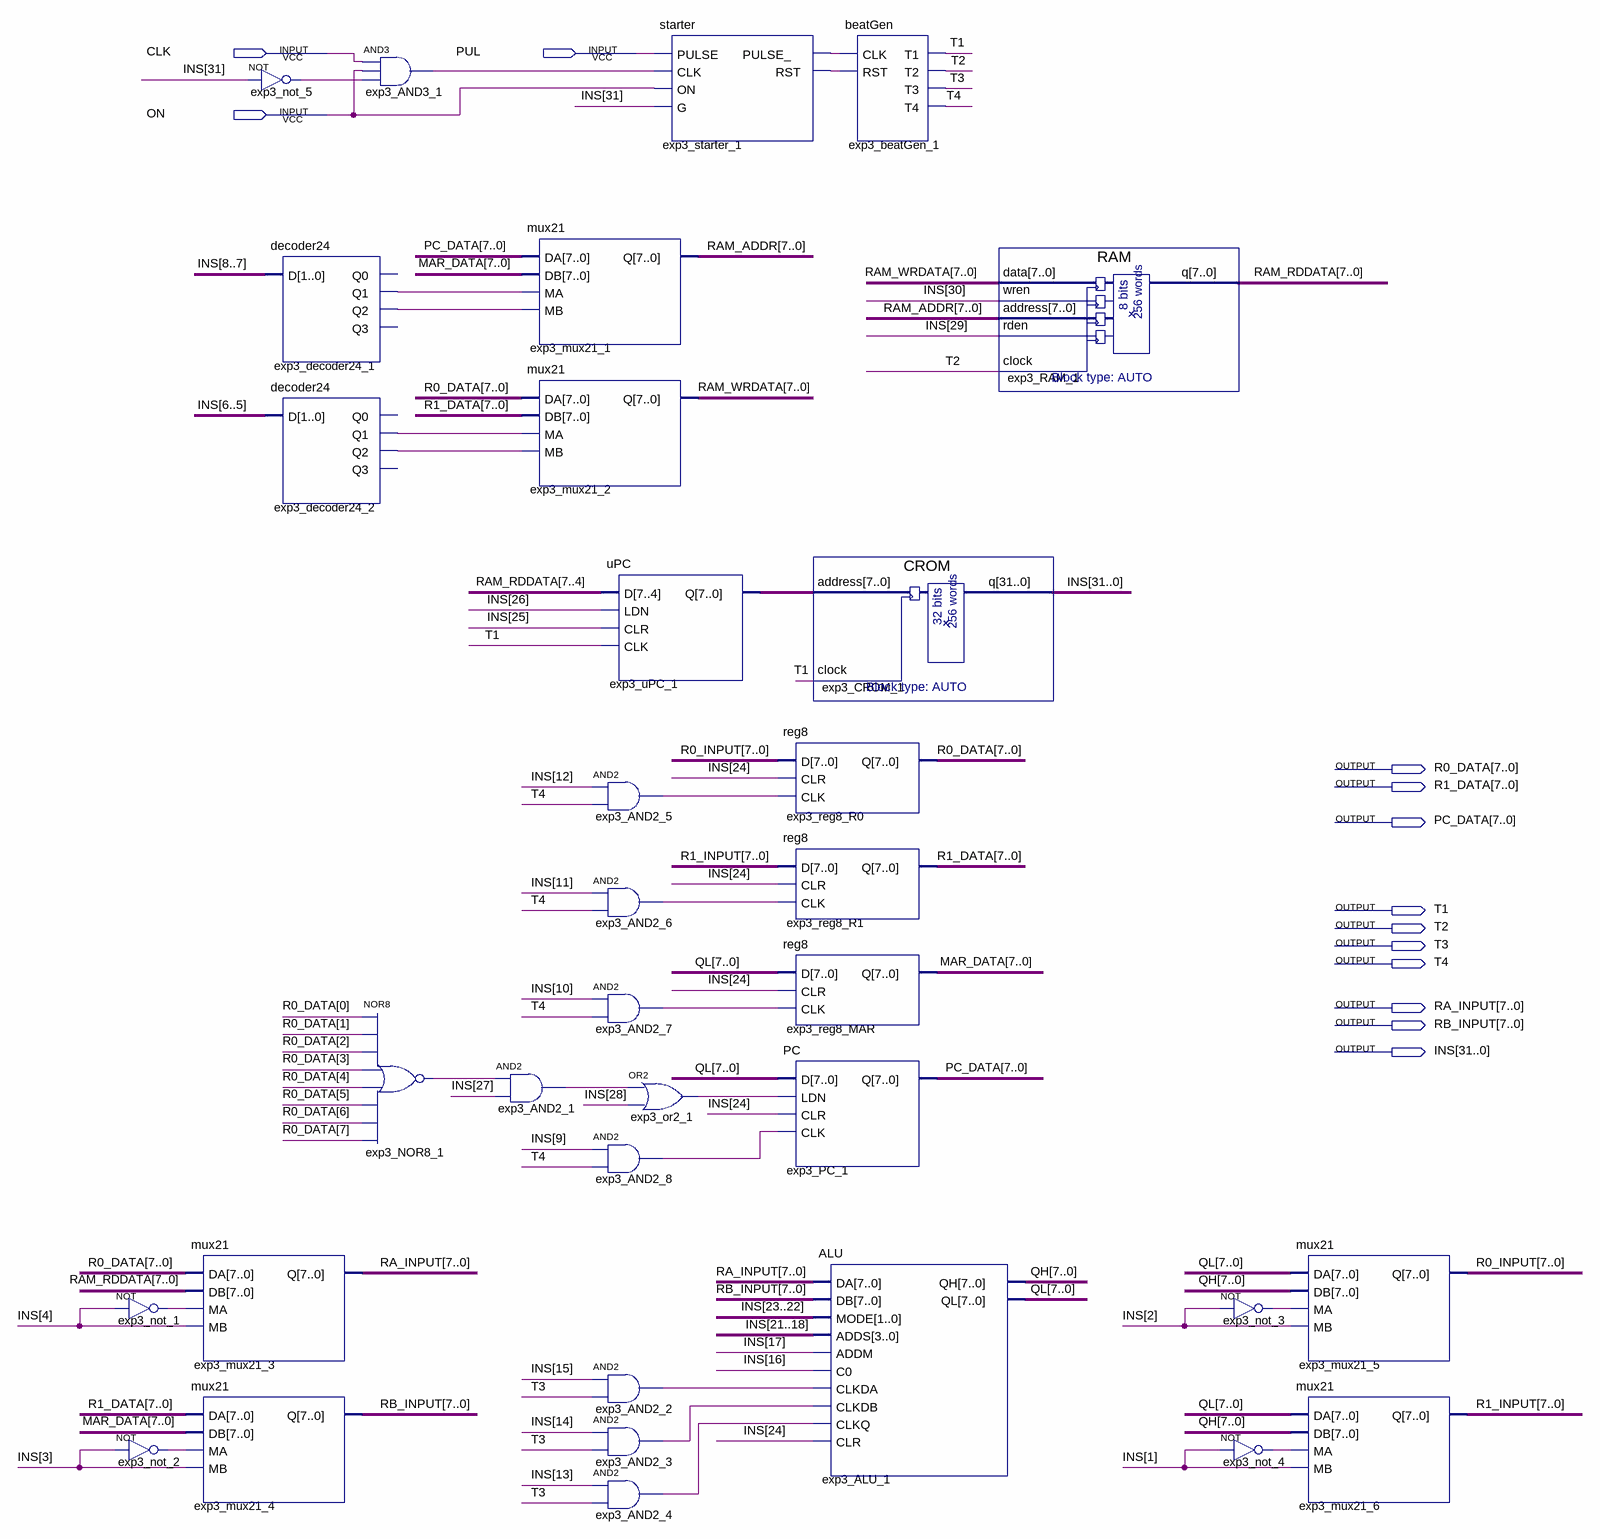
[diagram p0: schematic sheet]
// Quartus schematic exp3.bdf as structural Verilog: 34 symbols, 13 pins
module exp3 (
  input  CLK,
  input  PUL,
  input  ON,
  output [7:0] R0_DATA,
  output [7:0] R1_DATA,
  output [7:0] PC_DATA,
  output T1,
  output T2,
  output T3,
  output T4,
  output [7:0] RA_INPUT,
  output [7:0] RB_INPUT,
  output [31:0] INS
);

  wire exp3_AND2_1_out, exp3_AND2_2_out, exp3_AND2_3_out, exp3_AND2_4_out, exp3_AND2_5_out, exp3_AND2_6_out,
       exp3_AND2_7_out, exp3_AND2_8_out, exp3_AND3_1_out, exp3_decoder24_1_q1, exp3_decoder24_1_q2,
       exp3_decoder24_2_q1, exp3_decoder24_2_q2, exp3_NOR8_1_out, exp3_not_1_out, exp3_not_2_out,
       exp3_not_3_out, exp3_not_4_out, exp3_not_5_out, exp3_or2_1_out, exp3_starter_1_pulse_,
       exp3_starter_1_rst;
  wire [7:0] exp3_uPC_1_q, MAR_DATA, QH, QL, R0_INPUT, R1_INPUT, RAM_ADDR, RAM_RDDATA, RAM_WRDATA;

  not exp3_not_1 (exp3_not_1_out, INS[4]);
  not exp3_not_2 (exp3_not_2_out, INS[3]);
  not exp3_not_5 (exp3_not_5_out, INS[31]);
  mux21 exp3_mux21_3 (.DA(R0_DATA), .DB(RAM_RDDATA), .MA(exp3_not_1_out), .MB(INS[4]), .Q(RA_INPUT));
  mux21 exp3_mux21_4 (.DA(R1_DATA), .DB(MAR_DATA), .MA(exp3_not_2_out), .MB(INS[3]), .Q(RB_INPUT));
  decoder24 exp3_decoder24_1 (.D(INS[8:7]), .Q1(exp3_decoder24_1_q1), .Q2(exp3_decoder24_1_q2));  // open: Q0, Q3
  decoder24 exp3_decoder24_2 (.D(INS[6:5]), .Q1(exp3_decoder24_2_q1), .Q2(exp3_decoder24_2_q2));  // open: Q0, Q3
  and exp3_AND3_1 (exp3_AND3_1_out, CLK, ON, exp3_not_5_out);
  nor exp3_NOR8_1 (exp3_NOR8_1_out, R0_DATA[0], R0_DATA[1], R0_DATA[2], R0_DATA[3], R0_DATA[4], R0_DATA[5], R0_DATA[6], R0_DATA[7]);
  mux21 exp3_mux21_1 (.DA(PC_DATA), .DB(MAR_DATA), .MA(exp3_decoder24_1_q1), .MB(exp3_decoder24_1_q2), .Q(RAM_ADDR));
  mux21 exp3_mux21_2 (.DA(R0_DATA), .DB(R1_DATA), .MA(exp3_decoder24_2_q1), .MB(exp3_decoder24_2_q2), .Q(RAM_WRDATA));
  and exp3_AND2_1 (exp3_AND2_1_out, exp3_NOR8_1_out, INS[27]);
  uPC exp3_uPC_1 (.D(RAM_RDDATA[7:4]), .LDN(INS[26]), .CLR(INS[25]), .CLK(T1), .Q(exp3_uPC_1_q));
  and exp3_AND2_5 (exp3_AND2_5_out, INS[12], T4);
  and exp3_AND2_6 (exp3_AND2_6_out, INS[11], T4);
  and exp3_AND2_7 (exp3_AND2_7_out, INS[10], T4);
  and exp3_AND2_8 (exp3_AND2_8_out, INS[9], T4);
  and exp3_AND2_2 (exp3_AND2_2_out, INS[15], T3);
  and exp3_AND2_3 (exp3_AND2_3_out, INS[14], T3);
  and exp3_AND2_4 (exp3_AND2_4_out, INS[13], T3);
  starter exp3_starter_1 (
    .PULSE(PUL), .CLK(exp3_AND3_1_out), .ON(ON), .G(INS[31]), .PULSE_(exp3_starter_1_pulse_),
    .RST(exp3_starter_1_rst));
  or exp3_or2_1 (exp3_or2_1_out, exp3_AND2_1_out, INS[28]);
  CROM exp3_CROM_1 (.address(exp3_uPC_1_q), .clock(T1), .q(INS));
  reg8 exp3_reg8_R0 (.D(R0_INPUT), .CLR(INS[24]), .CLK(exp3_AND2_5_out), .Q(R0_DATA));
  reg8 exp3_reg8_R1 (.D(R1_INPUT), .CLR(INS[24]), .CLK(exp3_AND2_6_out), .Q(R1_DATA));
  reg8 exp3_reg8_MAR (.D(QL), .CLR(INS[24]), .CLK(exp3_AND2_7_out), .Q(MAR_DATA));
  PC exp3_PC_1 (.D(QL), .LDN(exp3_or2_1_out), .CLR(INS[24]), .CLK(exp3_AND2_8_out), .Q(PC_DATA));
  ALU exp3_ALU_1 (
    .DA(RA_INPUT), .DB(RB_INPUT), .MODE(INS[23:22]), .ADDS(INS[21:18]), .ADDM(INS[17]), .C0(INS[16]),
    .CLKDA(exp3_AND2_2_out), .CLKDB(exp3_AND2_3_out), .CLKQ(exp3_AND2_4_out), .CLR(INS[24]), .QH(QH), .QL(QL));
  beatGen exp3_beatGen_1 (.CLK(exp3_starter_1_pulse_), .RST(exp3_starter_1_rst), .T1(T1), .T2(T2), .T3(T3), .T4(T4));
  RAM exp3_RAM_1 (.data(RAM_WRDATA), .wren(INS[30]), .address(RAM_ADDR), .rden(INS[29]), .clock(T2), .q(RAM_RDDATA));
  not exp3_not_3 (exp3_not_3_out, INS[2]);
  not exp3_not_4 (exp3_not_4_out, INS[1]);
  mux21 exp3_mux21_5 (.DA(QL), .DB(QH), .MA(exp3_not_3_out), .MB(INS[2]), .Q(R0_INPUT));
  mux21 exp3_mux21_6 (.DA(QL), .DB(QH), .MA(exp3_not_4_out), .MB(INS[1]), .Q(R1_INPUT));
endmodule
